# Altium schematic sheet Ethernet2.SchDoc: ETHERNET 2
size A3; Date: Not used; ApprovedBy: Not used; CheckedBy: Not used; Author: Not used; CompanyName: STMicroelectronics; DrawnBy: Not used; Engineer: Not used; Organization: Not used; Address1: Not used; Address2: Not used; Address3: Not used; Address4: Not used; DocumentNumber: Not used; Revision: Not used; SheetNumber: 8; SheetTotal: 18; CurrentTime: Not used; CurrentDate: Not used; Time: Not used; DocumentFullPathAndName: Not used; DocumentName: Not used; ModifiedDate: Not used; ImagePath: Not used; ProjectName: Not used; Application_BuildNumber: Not used
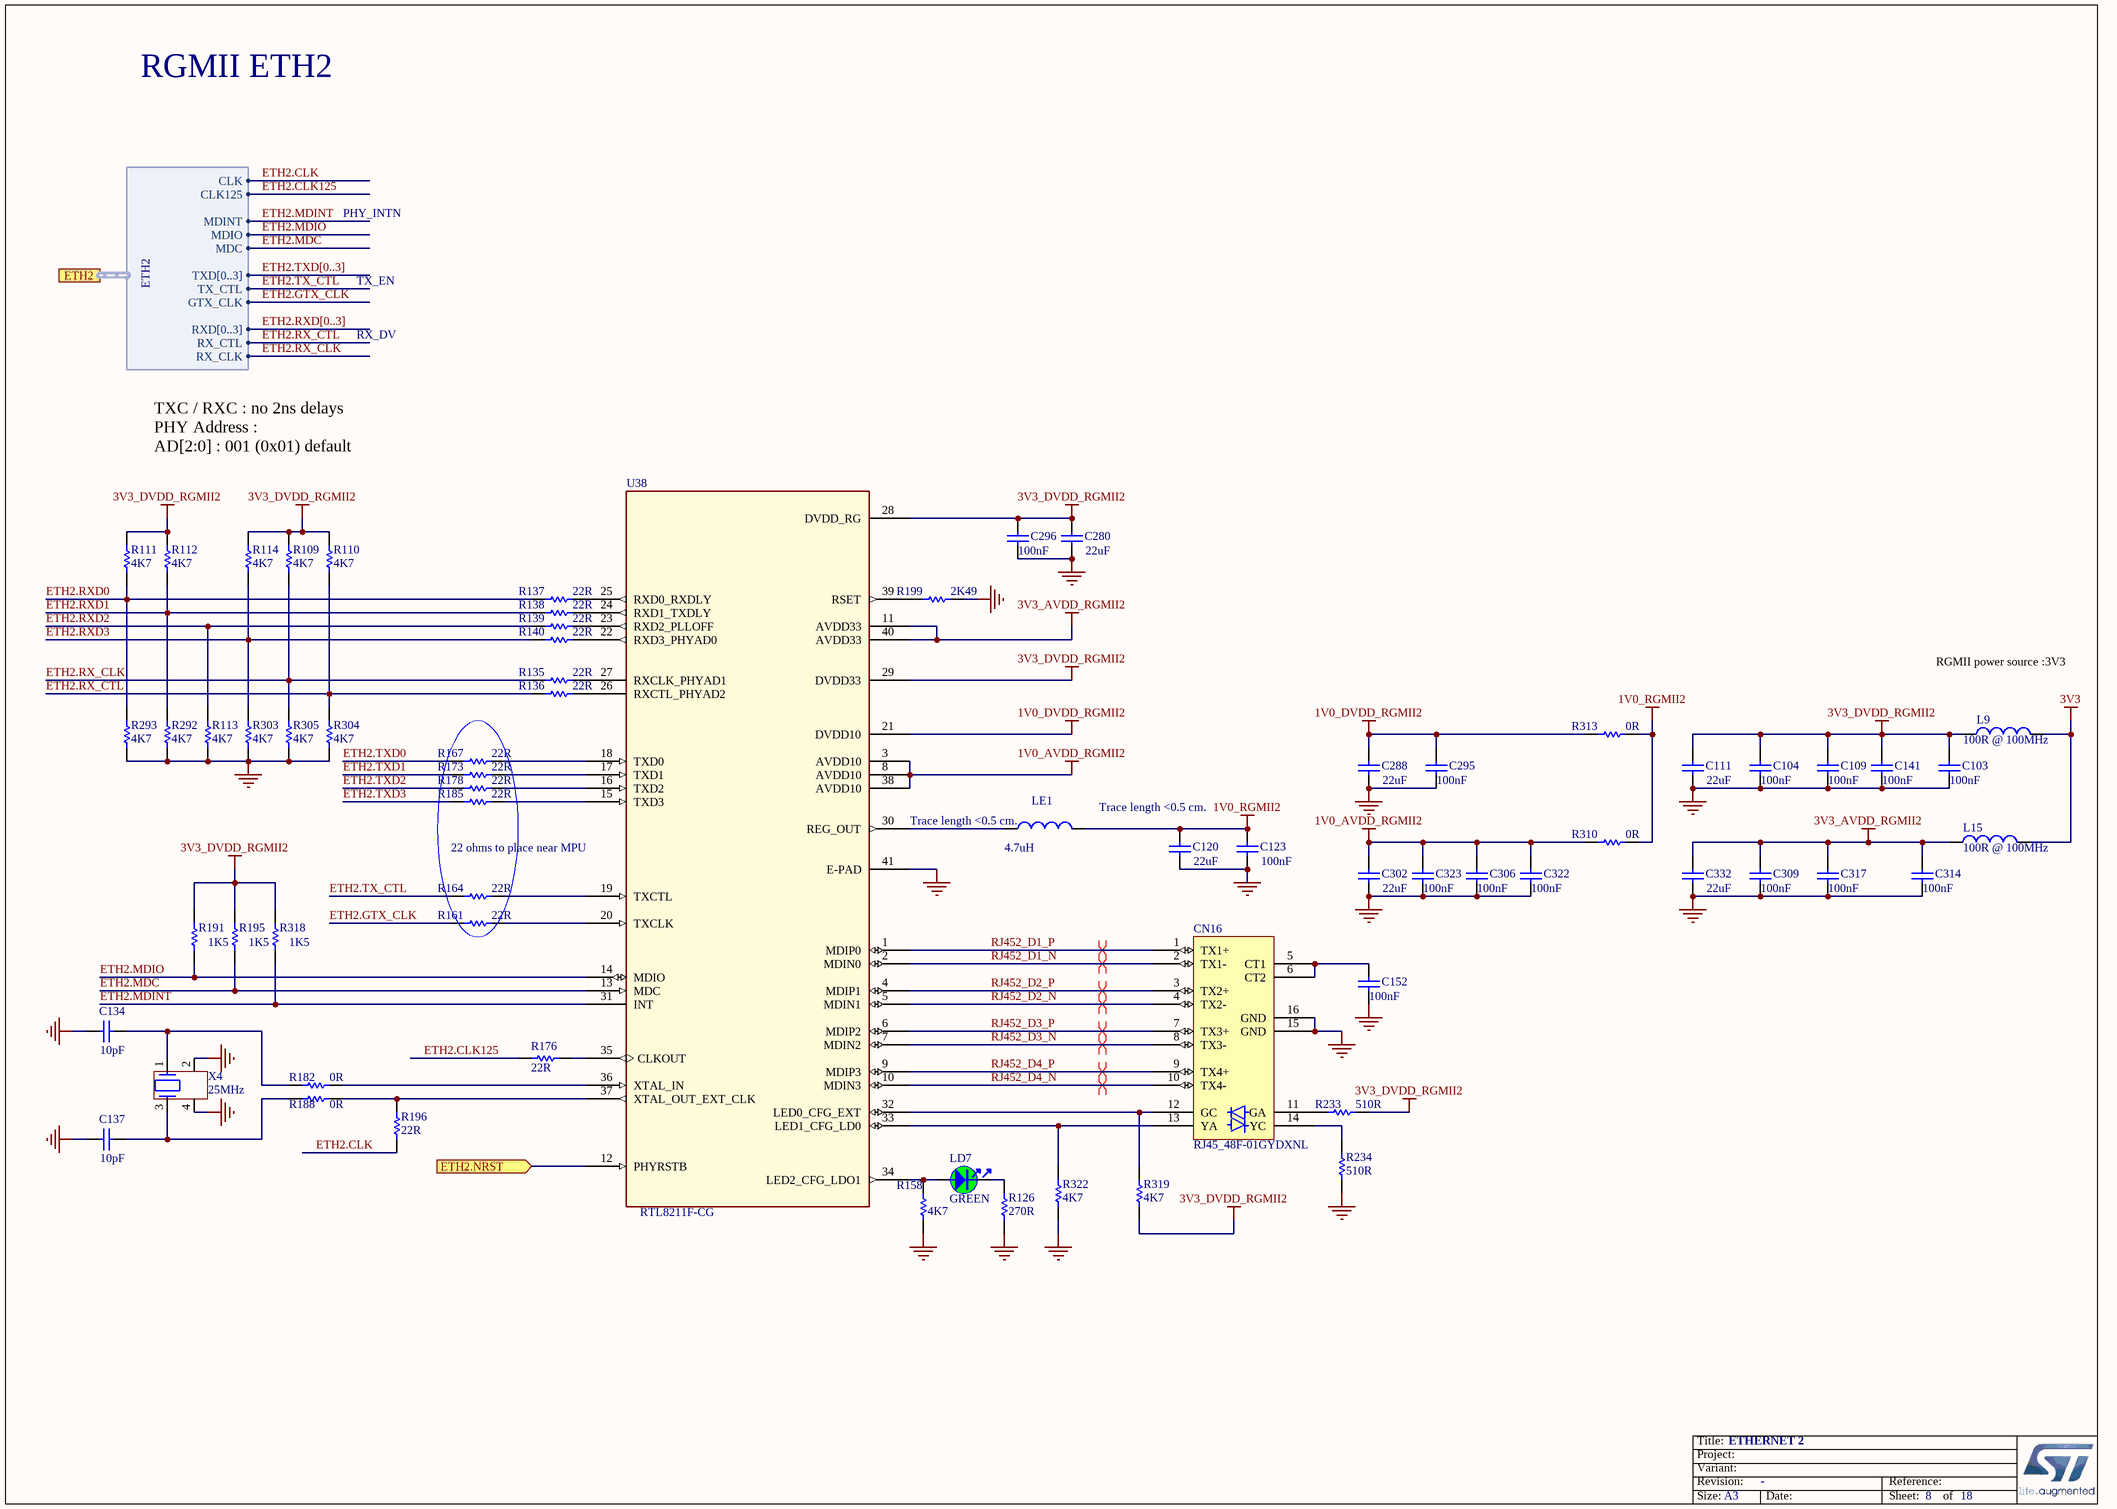
[diagram p0: Ethernet2.SchDoc]

## Parts
C103  value 100nF  [C0402]
C104  value 100nF  [C0402]
C109  value 100nF  [C0402]
C111  value 22uF  [C0603]
C120  value 22uF  [C0603]
C123  value 100nF  [C0402]
C134  value 10pF  [C0402]
C137  value 10pF  [C0402]
C141  value 100nF  [C0402]
C152  value 100nF  [C0402]
C280  value 22uF  [C0603]
C288  value 22uF  [C0603]
C295  value 100nF  [C0402]
C296  value 100nF  [C0402]
C302  value 22uF  [C0603]
C306  value 100nF  [C0402]
C309  value 100nF  [C0402]
C314  value 100nF  [C0402]
C317  value 100nF  [C0402]
C322  value 100nF  [C0402]
C323  value 100nF  [C0402]
C332  value 22uF  [C0603]
CN16  value RJ45_48F-01GYDXNL  [CON_RJ45_YD_48F-01GYDXNL_LED-P]  (hidden comment: ​New part for use of led pulled down on pin 13/14 , schematic more lisible.)
L9  value 100R @ 100MHz  [FIL_0603_H0P65]
L15  value 100R @ 100MHz  [FIL_0603_H0P65]
LD7  value GREEN  [LED_0603_OSRAM_LG-Q396-PS-35_GREEN_1A2K_H0P4]  (hidden comment: LED_green)
LE1  value 4.7uH  [L1210_LQH]
R109  value 4K7  [R0402]
R110  value 4K7  [R0402]
R111  value 4K7  [R0402]
R112  value 4K7  [R0402]
R113  value 4K7  [R0402]
R114  value 4K7  [R0402]
R126  value 270R  [R0402]  (hidden comment: Resistor)
R135  value 22R  [R0201_H0P23]  (hidden comment: Resistor)
R136  value 22R  [R0201_H0P23]  (hidden comment: Resistor)
R137  value 22R  [R0201_H0P23]  (hidden comment: Resistor)
R138  value 22R  [R0201_H0P23]  (hidden comment: Resistor)
R139  value 22R  [R0201_H0P23]  (hidden comment: Resistor)
R140  value 22R  [R0201_H0P23]  (hidden comment: Resistor)
R158  value 4K7  [R0402]
R161  value 22R  [R0201_H0P23]  (hidden comment: Resistor)
R164  value 22R  [R0201_H0P23]  (hidden comment: Resistor)
R167  value 22R  [R0201_H0P23]  (hidden comment: Resistor)
R173  value 22R  [R0201_H0P23]  (hidden comment: Resistor)
R176  value 22R  [R0201_H0P23]  (hidden comment: Resistor)
R178  value 22R  [R0201_H0P23]  (hidden comment: Resistor)
R182  value 0R  [R0402]
R185  value 22R  [R0201_H0P23]  (hidden comment: Resistor)
R188  value 0R  [R0402]
R191  value 1K5  [R0402]
R195  value 1K5  [R0402]
R196  value 22R  [R0201_H0P23]  (hidden comment: Resistor)
R199  value 2K49  [R0402]
R233  value 510R  [R0402]
R234  value 510R  [R0402]
R292  value 4K7  [R0402]
R293  value 4K7  [R0402]
R303  value 4K7  [R0402]
R304  value 4K7  [R0402]
R305  value 4K7  [R0402]
R310  value 0R  [R0603]
R313  value 0R  [R0603]
R318  value 1K5  [R0402]
R319  value 4K7  [R0402]
R322  value 4K7  [R0402]
U38  RTL8211F-CG  [ICC_QFN40-EPAD_5X5_P040]
X4  value 25MHz  [CRY_NX3225HA_4P]  (hidden comment: XTAL_4_PINS)

## Ports
ETH2 (harness ETH2), ETH2.NRST (in)

## Harnesses
ETH2: MDINT, CLK125, TXD[0..3], MDIO, MDC, RX_CLK, GTX_CLK, TX_CTL, RXD[0..3], RX_CTL, CLK

## Nets
1V0_AVDD_RGMII2: C302.2 C306.2 C322.2 C323.2 R310.1 U38.3(AVDD10) U38.8(AVDD10) U38.38(AVDD10)
1V0_DVDD_RGMII2: C288.2 C295.2 R313.1 U38.21(DVDD10)
1V0_RGMII2: C120.2 C123.2 LE1.2 R310.2 R313.2
3V3: L9.2 L15.2
3V3_AVDD_RGMII2: C309.2 C314.2 C317.2 C332.2 L15.1 U38.11(AVDD33) U38.40(AVDD33)
3V3_DVDD_RGMII2: C103.2 C104.2 C109.2 C111.2 C141.2 C280.1 C296.2 L9.1 R109.2 R110.2 R111.2 R112.2 R114.2 R191.2 R195.2 R233.2 R318.2 R319.1 U38.28(DVDD_RG) U38.29(DVDD33)
GND: C103.1 C104.1 C109.1 C111.1 C120.1 C123.1 C134.1 C137.1 C141.1 C152.1 C280.2 C288.1 C295.1 C296.1 C302.1 C306.1 C309.1 C314.1 C317.1 C322.1 C323.1 C332.1 CN16.15(GND) CN16.16(GND) R113.1 R126.2 R158.1 R199.2 R234.1 R292.1 R293.1 R303.1 R304.1 R305.1 R322.1 U38.41(E-PAD) X4.2 X4.4
ETH2.CLK: R196.1 ; port ETH2.CLK
ETH2.CLK125: R176.1 ; port ETH2.CLK125
ETH2.GTX_CLK: R161.1 ; port ETH2.GTX_CLK
ETH2.MDC: R195.1 U38.13(MDC) ; port ETH2.MDC
ETH2.MDINT: R318.1 U38.31(INT) ; port ETH2.MDINT
ETH2.MDIO: R191.1 U38.14(MDIO) ; port ETH2.MDIO
ETH2.NRST: U38.12(PHYRSTB) ; port ETH2.NRST
ETH2.RX_CLK: R109.1 R135.1 R305.2 ; port ETH2.RX_CLK
ETH2.RX_CTL: R110.1 R136.1 R304.2 ; port ETH2.RX_CTL
ETH2.RXD0: R111.1 R137.1 R293.2
ETH2.RXD1: R112.1 R138.1 R292.2
ETH2.RXD2: R113.2 R139.1
ETH2.RXD3: R114.1 R140.1 R303.2
ETH2.TX_CTL: R164.1 ; port ETH2.TX_CTL
ETH2.TXD0: R167.1
ETH2.TXD1: R173.1
ETH2.TXD2: R178.1
ETH2.TXD3: R185.1
RJ452_D1_N: CN16.2(TX1-) U38.2(MDIN0)
RJ452_D1_P: CN16.1(TX1+) U38.1(MDIP0)
RJ452_D2_N: CN16.4(TX2-) U38.5(MDIN1)
RJ452_D2_P: CN16.3(TX2+) U38.4(MDIP1)
RJ452_D3_N: CN16.8(TX3-) U38.7(MDIN2)
RJ452_D3_P: CN16.7(TX3+) U38.6(MDIP2)
RJ452_D4_N: CN16.10(TX4-) U38.10(MDIN3)
RJ452_D4_P: CN16.9(TX4+) U38.9(MDIP3)
NetC134_2: C134.2 R182.1 X4.1
NetC137_2: C137.2 R188.1 X4.3
NetC152_2: C152.2 CN16.5(CT1) CN16.6(CT2)
NetCN16_11: CN16.11(GA) R233.1
NetCN16_12: CN16.12(GC) R319.2 U38.32(LED0_CFG_EXT)
NetCN16_13: CN16.13(YA) R322.2 U38.33(LED1_CFG_LD0)
NetCN16_14: CN16.14(YC) R234.2
NetLD7_1: LD7.1 R158.2 U38.34(LED2_CFG_LDO1)
NetLD7_2: LD7.2 R126.1
NetLE1_1: LE1.1 U38.30(REG_OUT)
NetR135_2: R135.2 U38.27(RXCLK_PHYAD1)
NetR136_2: R136.2 U38.26(RXCTL_PHYAD2)
NetR137_2: R137.2 U38.25(RXD0_RXDLY)
NetR138_2: R138.2 U38.24(RXD1_TXDLY)
NetR139_2: R139.2 U38.23(RXD2_PLLOFF)
NetR140_2: R140.2 U38.22(RXD3_PHYAD0)
NetR161_2: R161.2 U38.20(TXCLK)
NetR164_2: R164.2 U38.19(TXCTL)
NetR167_2: R167.2 U38.18(TXD0)
NetR173_2: R173.2 U38.17(TXD1)
NetR176_2: R176.2 U38.35(CLKOUT)
NetR178_2: R178.2 U38.16(TXD2)
NetR182_2: R182.2 U38.36(XTAL_IN)
NetR185_2: R185.2 U38.15(TXD3)
NetR188_2: R188.2 R196.2 U38.37(XTAL_OUT_EXT_CLK)
NetR199_1: R199.1 U38.39(RSET)

## Buses and harness runs
bus ETH2.RXD[0..3]
bus ETH2.TXD[0..3]

## Layout directives
differential pair: RJ452_D1_N, RJ452_D1_P, RJ452_D2_N, RJ452_D2_P, RJ452_D3_N, RJ452_D3_P, RJ452_D4_N, RJ452_D4_P

## Notes on the sheet
- RGMII ETH2
- PHY_INTN
- TX_EN
- RX_DV
- TXC / RXC : no 2ns delays
  PHY Address :
  AD[2:0] : 001 (0x01) default
- RGMII power source :3V3
- (near U38) 22 ohms to place near MPU
- (near LE1) Trace length <0.5 cm.
- Trace length <0.5 cm.
- Title:
- Project:
- Size:
- Revision:
- Variant:
- A3
- -
- Date:
- Reference:
- Sheet:
- of

## Library data of the parts
C103 C104 C109 C123 C141 C152 C295 C296 C306 C309 C314 C317 C322 C323 = MCD-00006: Capacitor,100nF,16V,X7R,10%,0402; Manufacturer_Part_Number: CC0402KRX7R7BB104; Manufacturer: YAGEO; Alternate_Manufacturer: MURATA; Alternate_Manufacturer_Part_Number: GCM155R71C104KA55D; Part_Preference: Recommended; Provided_By: SUBCO; Initial_Board_Reference: mb1274; Order_Code_RS: 616-9701; Component_Country_Of_Origin: China; ID: 2474; ShowFields: YES; Internal_Part_Number: MCD-00006; ComponentLink1Description: Datasheet; ECCN_US: n/a; ECCN_EU: n/a; Status: Released; Part_Type: Capacitor; Package: 0402; ComponentLink1URL: http://tunmcdsvn.tun.st.com/Component_Documentation_Library/Trunk/Capacitor/YAGEO_X7R_Series; Order_Code_Digikey: 311-1338-1-ND; Order_Code_Farnell: 9402047
C111 C120 C280 C288 C302 C332 = MCD-00100: Capacitor,22uF,6V3,X5R,20%,0603; Manufacturer_Part_Number: GRM188R60J226MEA0J; Manufacturer: MURATA; Part_Preference: Recommended; ECCN_US: EAR99; ECCN_EU: NEC; Provided_By: SUBCO; Initial_Board_Reference: mb1262; Component_Country_Of_Origin: Japan; ID: 2766; ShowFields: YES; Internal_Part_Number: MCD-00100; ComponentLink1Description: Datasheet; Status: Released; Part_Type: Capacitor; Package: 0603; ComponentLink1URL: http://tunmcdsvn.tun.st.com/Component_Documentation_Library/Trunk/Capacitor/MURATA_GRM_Series; Order_Code_Digikey: 490-7612-2-ND; Order_Code_Farnell: N/A; Order_Code_RS: N/A
C134 C137 = MCD-00015: Capacitor,10pF,50V,NPO,5%,0402; Manufacturer_Part_Number: CC0402JRNPO9BN100; Manufacturer: YAGEO; Part_Preference: Recommended; Provided_By: SUBCO; Initial_Board_Reference: mb1274; Order_Code_RS: 616-9256; Component_Country_Of_Origin: China; ID: 2465; ShowFields: YES; Internal_Part_Number: MCD-00015; ComponentLink1Description: Datasheet; ECCN_US: n/a; ECCN_EU: n/a; Status: Released; Part_Type: Capacitor; Package: 0402; ComponentLink1URL: http://tunmcdsvn.tun.st.com/Component_Documentation_Library/Trunk/Capacitor/YAGEO_NP0_Series; Order_Code_Digikey: 311-1014-1-ND; Order_Code_Farnell: 3019160RL
CN16 = MCD-01129: Connector_RJ45, led pull down, T= 13.84mm; Manufacturer_Part_Number: 48F-01GYDXNL; Manufacturer: YUAN DEAN SCIENTIFIC; Part_Preference: Recommended; Component_Country_Of_Origin: Unknown; ID: 3367; ShowFields: YES; Internal_Part_Number: MCD-01129; Status: New; Part_Type: Connector; ComponentLink1URL: http://tunmcdsvn.tun.st.com/Component_Documentation_Library/Trunk/Connector/YUAN_DEAN_SCIENTIFIC_48F_Series/; Order_Code_Digikey: N/A; Order_Code_Farnell: N/A; Order_Code_RS: N/A
L9 L15 = MCD-00094: Ferrite bead 100R 2A 0603; Manufacturer_Part_Number: BLM18EG101TN1; Manufacturer: MURATA; Part_Type: Inductor; Part_Preference: Recommended; ECCN_US: EAR99; ECCN_EU: NEC; Provided_By: SUBCO; Initial_Board_Reference: mb1262; Order_Code_RS: 792-6246; Component_Country_Of_Origin: Japan; ID: 2774; ShowFields: YES; Internal_Part_Number: MCD-00094; ComponentLink1Description: Datasheet; Status: Released; ComponentLink1URL: http://tunmcdsvn.tun.st.com/Component_Documentation_Library/Trunk/Inductor/MURATA_BLM_Series; Order_Code_Digikey: 490-5978-2-ND; Order_Code_Farnell: 1515714; Package: 0603
LD7 = MCD-00588: LED Green, 0603 SMD, Forward Voltage Typ=2V, Max=2.5V; Part_Type: Display; Manufacturer_Part_Number: LG Q396-PS-35; Manufacturer: OSRAM OPTO SEMICONDUCTORS; Alternate_Manufacturer_Part_Number: VLMTG1300-GS08; Alternate_Manufacturer: VISHAY SEMICONDUCTOR OPTO DIVISION; Alternate_Internal_Part_Number: MCD-02400; Part_Preference: Recommended; Provided_By: SUBCO; Component_Country_Of_Origin: Unknown; ID: 3155; ShowFields: YES; Internal_Part_Number: MCD-00588; Status: Released; Package: LED 0603; ComponentLink1Description: Datasheet; ComponentLink1URL: http://tunmcdsvn.tun.st.com/Component_Datasheet_Library/Trunk/Display/OSRAM_LED_GREEN_LG Q396-PS-35; Order_Code_Digikey: LG Q396-PS-35-ND; ECCN_US: n/a; ECCN_EU: n/a
LE1 = MCD-00048: FIXED IND 4.7UH 1A 180 MOHM 30% SMD; Manufacturer_Part_Number: LQH32PN4R7NN0L; Manufacturer: MURATA; Part_Preference: Recommended; Provided_By: SUBCO; Initial_Board_Reference: mb1274; Order_Code_RS: 167-4086; Component_Country_Of_Origin: Japan; ID: 2544; ShowFields: YES; Internal_Part_Number: MCD-00048; ComponentLink1Description: Datasheet; ECCN_US: n/a; ECCN_EU: n/a; Status: Released; Part_Type: Inductor; ComponentLink1URL: http://tunmcdsvn.tun.st.com/Component_Documentation_Library/Trunk/Inductor/MURATA_LQH32PN4R7NN0; Order_Code_Digikey: 490-5338-2-ND; Order_Code_Farnell: 2470296; Package: 1210
R109-R114 R292 R293 R303-R305 = MCD-00065: Resistor,4K7,0402,1%,1/16W; Manufacturer_Part_Number: RC0402FR-074K7L; Manufacturer: YAGEO; Alternate_Manufacturer_Part_Number: RT0402FRE074K7L; Provided_By: SUBCO; Initial_Board_Reference: mb1274; Internal_Part_Number: MCD-00065; Alternate_Manufacturer: YAGEO; ComponentLink1Description: Datasheet; ECCN_US: n/a; ECCN_EU: n/a; Status: Released; Part_Type: Resistor; ComponentLink1URL: http://tunmcdsvn.tun.st.com/Component_Datasheet_Library/Trunk/Resistors/Yageo_Resistor_RC0402-series; Package: R0402
R126 = MCD-00441: Resistor,270R,0402,1%,1/16W; Manufacturer_Part_Number: RC0402FR-07270RL; Manufacturer: YAGEO; Part_Preference: Recommended; Provided_By: SUBCO; ECCN_US: EAR99; ECCN_EU: NEC; Component_Country_Of_Origin: China; ID: 2838; ShowFields: YES; Internal_Part_Number: MCD-00441; Status: Released; Part_Type: Resistor; Package: 0402; ComponentLink1Description: Datasheet; ComponentLink1URL: http://tunmcdsvn.tun.st.com/Component_Documentation_Library/Trunk/Resistor/YAGEO_RC_L_Series; Order_Code_Digikey: 311-270LRCT-ND; Order_Code_Farnell: 9239162; Order_Code_RS: N/A
R135-R140 R161 R164 R167 R173 R176 R178 R185 R196 = MCD-02978: Resistor, 22R, 0201, +/-1%, 1/20W; Manufacturer_Part_Number: RC0201FR-0722RL; Manufacturer: YAGEO; Part_Preference: Recommended; Order_Code_RS: 198-7593; ID: 5094; ShowFields: YES; Internal_Part_Number: MCD-02978; Status: New; Part_Type: Resistor; ComponentLink1URL: http://tunmcdsvn.tun.st.com/Component_Documentation_Library/Trunk/Resistor/YAGEO_RC_L_Series; Package: 0201; Order_Code_Digikey: YAG2518TR-ND; Order_Code_Farnell: 2693564
R158 R319 R322 = MCD-00065: Resistor,4K7,0402,1%,1/16W; Manufacturer_Part_Number: RC0402FR-074K7L; Manufacturer: YAGEO; Alternate_Manufacturer_Part_Number: RT0402FRE074K7L; Part_Preference: Recommended; Provided_By: SUBCO; Initial_Board_Reference: mb1274; Component_Country_Of_Origin: China; ID: 2526; ShowFields: YES; Internal_Part_Number: MCD-00065; Alternate_Manufacturer: YAGEO; ComponentLink1Description: Datasheet; ECCN_US: n/a; ECCN_EU: n/a; Status: Released; Part_Type: Resistor; ComponentLink1URL: http://tunmcdsvn.tun.st.com/Component_Documentation_Library/Trunk/Resistor/YAGEO_RC_L_Series; Package: 0402; Order_Code_Digikey: 311-4.7KLRCT-ND; Order_Code_Farnell: 9239316; Order_Code_RS: N/A
R182 R188 = MCD-00052: Resistor,0R,0402,5%,1/16W; Manufacturer_Part_Number: RC0402JR-070RL; Manufacturer: YAGEO; Part_Preference: Recommended; Provided_By: SUBCO; Initial_Board_Reference: mb1274; Order_Code_RS: 618-5804; Component_Country_Of_Origin: China; ID: 2540; ShowFields: YES; Internal_Part_Number: MCD-00052; ComponentLink1Description: Datasheet; ECCN_US: n/a; ECCN_EU: n/a; Status: Released; Part_Type: Resistor; ComponentLink1URL: http://tunmcdsvn.tun.st.com/Component_Documentation_Library/Trunk/Resistor/YAGEO_RC_L_Series; Package: 0402; Order_Code_Digikey: 311-0.0JRCT-ND; Order_Code_Farnell: 9232516RL
R191 R195 R318 = MCD-00068: Resistor,1K5,0402,1%,1/16W; Manufacturer_Part_Number: RC0402FR-071K5L; Manufacturer: YAGEO; Part_Preference: Recommended; Provided_By: SUBCO; Initial_Board_Reference: mb1274; Component_Country_Of_Origin: China; ID: 2524; ShowFields: YES; Internal_Part_Number: MCD-00068; ComponentLink1Description: Datasheet; ECCN_US: n/a; ECCN_EU: n/a; Status: Released; Part_Type: Resistor; ComponentLink1URL: http://tunmcdsvn.tun.st.com/Component_Documentation_Library/Trunk/Resistor/YAGEO_RC_L_Series; Package: 0402; Order_Code_Digikey: 311-1.50KLRCT-ND; Order_Code_Farnell: 9239251; Order_Code_RS: N/A
R199 = MCD-00183: Resistor,2K49,0402,1%,1/16W; Manufacturer_Part_Number: RC0402FR-072K49L; Manufacturer: YAGEO; Part_Preference: Recommended; Provided_By: SUBCO; Component_Country_Of_Origin: China; ID: 2687; ShowFields: YES; Internal_Part_Number: MCD-00183; ComponentLink1Description: Datasheet; ECCN_US: n/a; ECCN_EU: n/a; Status: Released; Part_Type: Resistor; ComponentLink1URL: http://tunmcdsvn.tun.st.com/Component_Documentation_Library/Trunk/Resistor/YAGEO_RC_L_Series; Package: 0402; Order_Code_Digikey: 311-2.49KLRCT-ND; Order_Code_Farnell: 1799190; Order_Code_RS: N/A
R233 R234 = MCD-00064: Resistor,510R,0402,1%,1/16W; Manufacturer_Part_Number: RC0402FR-07510RL; Manufacturer: YAGEO; Part_Preference: Recommended; Provided_By: SUBCO; Initial_Board_Reference: mb1274; Component_Country_Of_Origin: China; ID: 2525; ShowFields: YES; Internal_Part_Number: MCD-00064; ComponentLink1Description: Datasheet; ECCN_US: n/a; ECCN_EU: n/a; Status: Released; Part_Type: Resistor; ComponentLink1URL: http://tunmcdsvn.tun.st.com/Component_Documentation_Library/Trunk/Resistor/YAGEO_RC_L_Series; Package: 0402; Order_Code_Digikey: 311-510LRCT-ND; Order_Code_Farnell: 1458804; Order_Code_RS: N/A
R310 R313 = MCD-00056: Resistor,0R,0603,5%,1/10W; Manufacturer_Part_Number: RC0603JR-070RL; Manufacturer: YAGEO; Part_Preference: Recommended; Provided_By: SUBCO; Initial_Board_Reference: mb1274; Component_Country_Of_Origin: China; ID: 2536; ShowFields: YES; Internal_Part_Number: MCD-00056; ComponentLink1Description: Datasheet; ECCN_US: n/a; ECCN_EU: n/a; Status: Released; Part_Type: Resistor; ComponentLink1URL: http://tunmcdsvn.tun.st.com/Component_Documentation_Library/Trunk/Resistor/YAGEO_RC_L_Series; Package: 0603; Order_Code_Digikey: 311-0.0GRCT-ND; Order_Code_Farnell: 9233130RL; Order_Code_RS: N/A
U38 = MCD-01130: 10/100/1000M GIGABIT Ethernet Transceiver, QFN40 , SMPS version; Manufacturer: REALTEK; Part_Type: IC; Part_Preference: Recommended; Provided_By: SUBCO; Initial_Board_Reference: MB1272; Component_Country_Of_Origin: Unknown; ID: 3370; ShowFields: YES; Value: RTL8211F-CG; Internal_Part_Number: MCD-01130; Manufacturer_Part_Number: RTL8211F-CG; ComponentLink1Description: Datasheet; ComponentLink1URL: http://tunmcdsvn.tun.st.com/Component_Datasheet_Library/Trunk/IC/REALTEK_RTL8211F_RGMII_phy; Status: Checked; ECCN_US: n/a; ECCN_EU: n/a
X4 = MCD-01463: Crystal 25Mhz, 10pF, -+50PPM, SMD; Part_Type: Crystal_Osc; Manufacturer_Part_Number: NX3225GA-25MHZ-EXS00A-CG06750; Manufacturer: NDK; BMS_Part_Number: 9157035; Part_Preference: Recommended; Provided_By: SUBCO; Initial_Board_Reference: MB1272B; Remark: footprint same as CRY_NX3225HA_4P; Component_Country_Of_Origin: Unknown; ID: 3563; ShowFields: YES; Internal_Part_Number: MCD-01463; Status: Checked; Package: 3.2x2.5mm; ComponentLink1Description: Datasheet; ComponentLink1URL: http://tunmcdsvn.tun.st.com/Component_Documentation_Library/Trunk/Crytal_Oscillator/NDK_NX3225GA_Series; Order_Code_Digikey: 644-1390; Order_Code_Farnell: N/A; Order_Code_RS: N/A